# EAGLE design bee_duel_played (EAGLE 9.6.2)
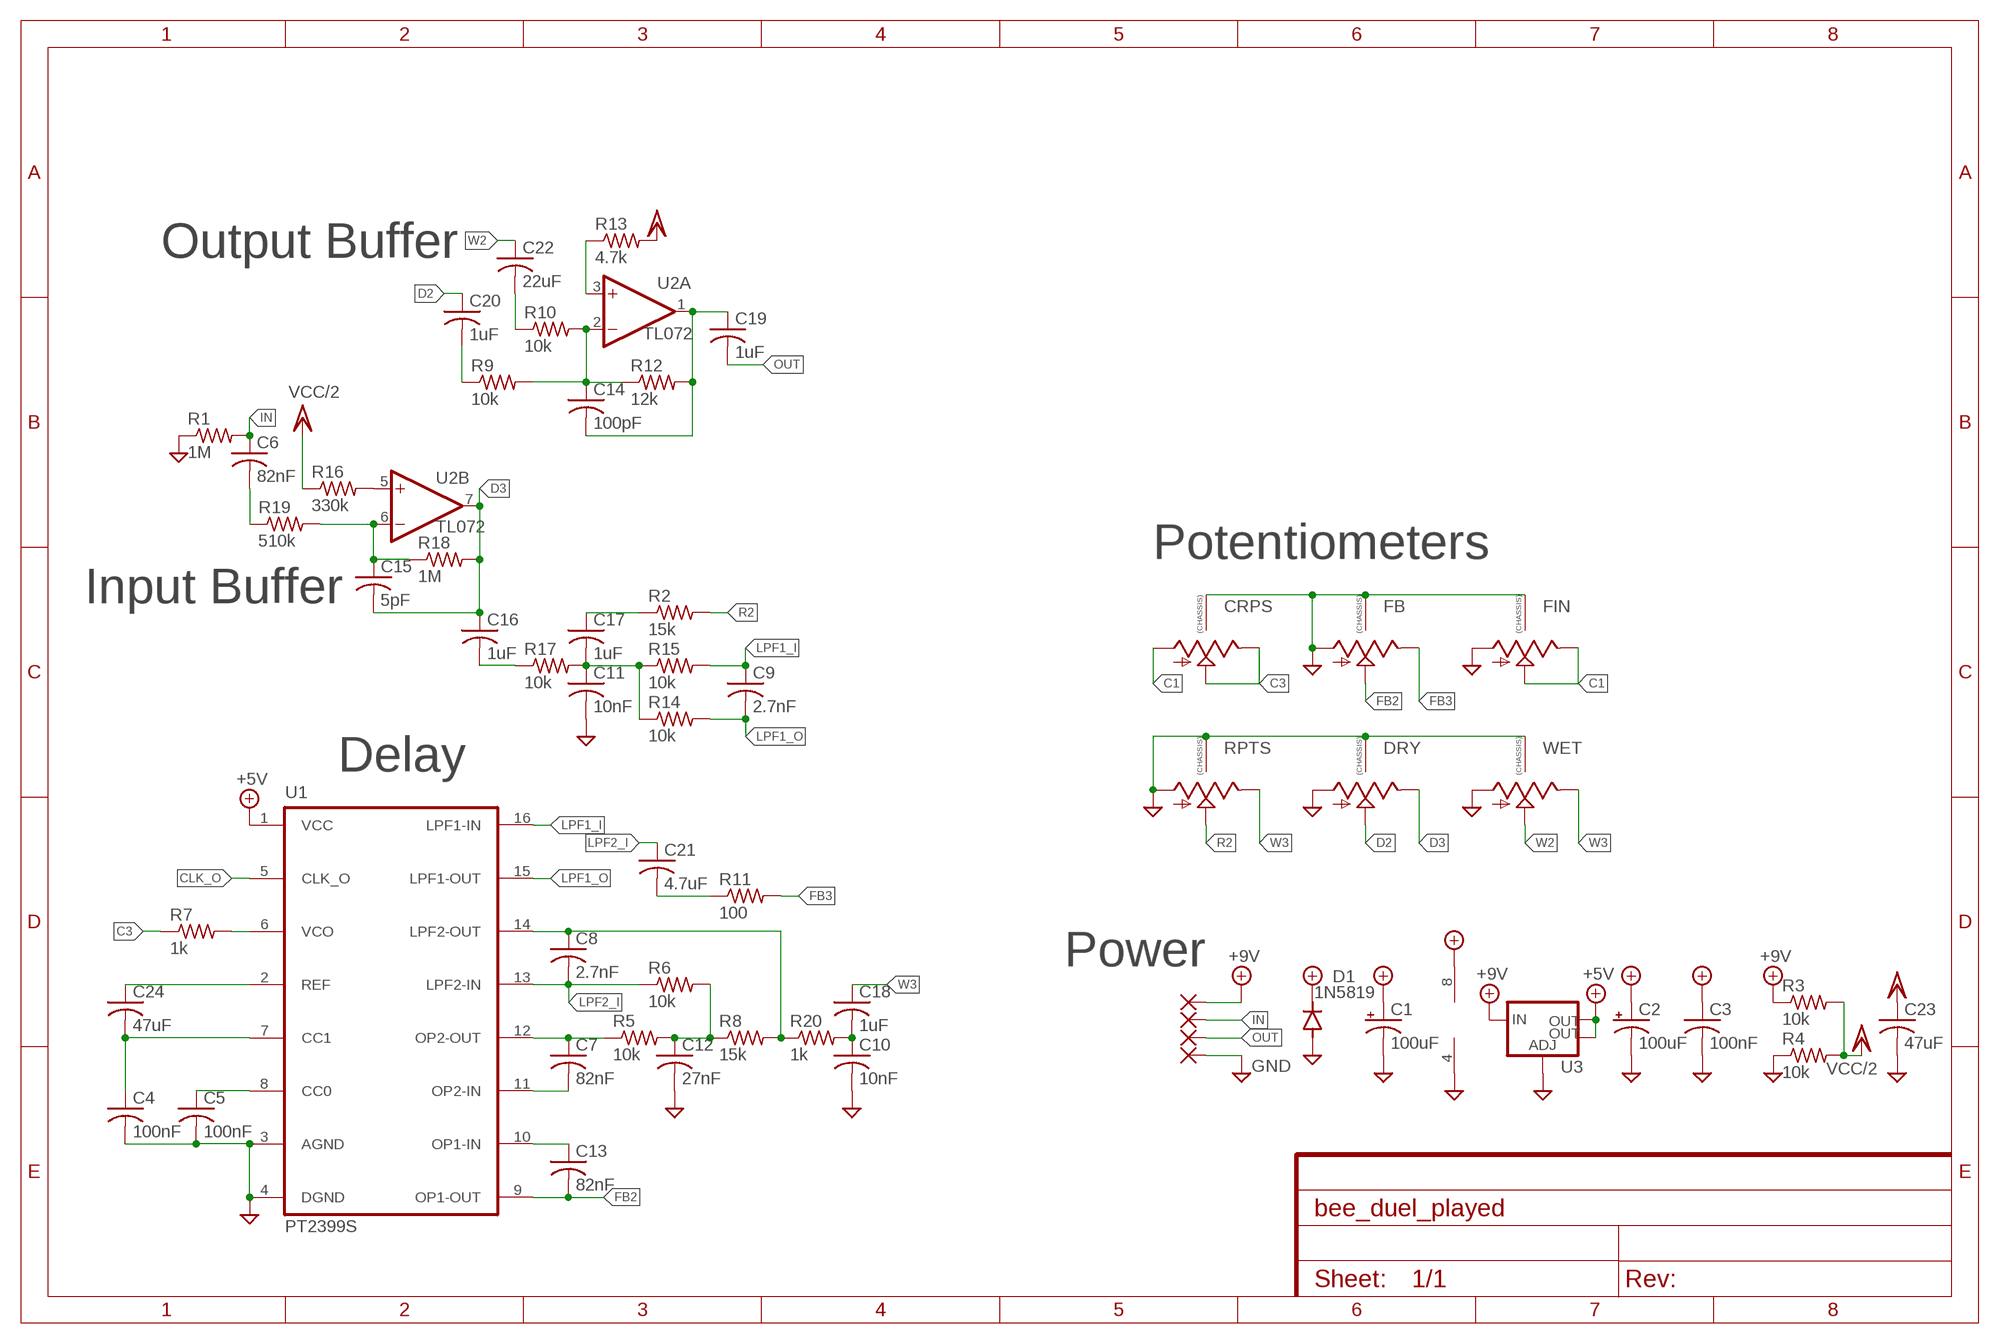
[diagram p0: schematic, sheet 1]

## Parts
C1  100uF  100UF-POLAR-RADIAL-2.5MM-25V-20%  [CPOL-RADIAL-2.5MM-6.5MM]
C2  100uF  100UF-POLAR-RADIAL-2.5MM-25V-20%  [CPOL-RADIAL-2.5MM-6.5MM]
C3  100nF  C-USC0603  [C0603]
C4  100nF  C-USC0603  [C0603]
C5  100nF  C-USC0603  [C0603]
C6  82nF  C-USC0603  [C0603]
C7  82nF  C-USC0603  [C0603]
C8  2.7nF  C-USC0603  [C0603]
C9  2.7nF  C-USC0603  [C0603]
C10  10nF  C-USC0603  [C0603]
C11  10nF  C-USC0603  [C0603]
C12  27nF  C-USC0603  [C0603]
C13  82nF  C-USC0603  [C0603]
C14  100pF  C-USC0603  [C0603]
C15  5pF  C-USC0603  [C0603]
C16  1uF  C-USC0603  [C0603]
C17  1uF  C-USC0603  [C0603]
C18  1uF  C-USC0603  [C0603]
C19  1uF  C-USC0603  [C0603]
C20  1uF  C-USC0603  [C0603]
C21  4.7uF  C-USC0805  [C0805]
C22  22uF  C-USC1210  [C1210]
C23  47uF  C-USC1210  [C1210]
C24  47uF  C-USC1210  [C1210]
CRPS  9MM_SNAP-IN_POT_CHASSIS  [9MM_SNAP-IN_POT]
D1  1N5819  DIODE-SOD123  [SOD123]
DRY  9MM_SNAP-IN_POT_CHASSIS  [9MM_SNAP-IN_POT]
FB  9MM_SNAP-IN_POT_CHASSIS  [9MM_SNAP-IN_POT]
FIN  9MM_SNAP-IN_POT_CHASSIS  [9MM_SNAP-IN_POT]
PAD1  1,6/0,8  [1,6/0,8]
PAD2  1,6/0,8  [1,6/0,8]
PAD3  1,6/0,8  [1,6/0,8]
PAD4  1,6/0,8  [1,6/0,8]
R1  1M  R-US_R0603  [R0603]
R2  15k  R-US_R0603  [R0603]
R3  10k  R-US_R0603  [R0603]
R4  10k  R-US_R0603  [R0603]
R5  10k  R-US_R0603  [R0603]
R6  10k  R-US_R0603  [R0603]
R7  1k  R-US_R0603  [R0603]
R8  15k  R-US_R0603  [R0603]
R9  10k  R-US_R0603  [R0603]
R10  10k  R-US_R0603  [R0603]
R11  100  R-US_R0603  [R0603]
R12  12k  R-US_R0603  [R0603]
R13  4.7k  R-US_R0603  [R0603]
R14  10k  R-US_R0603  [R0603]
R15  10k  R-US_R0603  [R0603]
R16  330k  R-US_R0603  [R0603]
R17  10k  R-US_R0603  [R0603]
R18  1M  R-US_R0603  [R0603]
R19  510k  R-US_R0603  [R0603]
R20  1k  R-US_R0603  [R0603]
RPTS  9MM_SNAP-IN_POT_CHASSIS  [9MM_SNAP-IN_POT]
U1  PT2399S  [SO16W]
U2  TL072  TL072TSSOP  [TSSOP-8]
U3  V_REG_LM1117SOT223  [SOT223]
WET  9MM_SNAP-IN_POT_CHASSIS  [9MM_SNAP-IN_POT]

## Nets
+5V: C2.1(+) C3.1 U1.1(VCC) U3.2(OUT) U3.4(OUT)
+9V: C1.1(+) D1.C PAD1.1(P) R3.1 U2.8(P:V+) U3.3(IN)
C1: CRPS.1(A) FIN.2(S) FIN.3(E)
C3: CRPS.2(S) CRPS.3(E) R7.1
CLK_O: U1.5(CLK_O)
D2: C20.1 DRY.2(S)
D3: C15.2 C16.1 DRY.3(E) R18.2 U2.7(B:OUT)
FB2: C13.2 FB.2(S) U1.9(OP1-OUT)
FB3: FB.3(E) R11.2
GND: C1.2(-) C2.2(-) C3.2 C4.2 C5.2 C10.2 C11.2 C12.2 C23.2 CRPS.CHASSIS1 CRPS.CHASSIS2 D1.A DRY.1(A) DRY.CHASSIS1 DRY.CHASSIS2 FB.1(A) FB.CHASSIS1 FB.CHASSIS2 FIN.1(A) FIN.CHASSIS1 FIN.CHASSIS2 PAD4.1(P) R1.1 R4.1 RPTS.1(A) RPTS.CHASSIS1 RPTS.CHASSIS2 U1.3(AGND) U1.4(DGND) U2.4(P:V-) U3.1(ADJ) WET.1(A) WET.CHASSIS1 WET.CHASSIS2
IN: C6.1 PAD2.1(P) R1.2
LPF1_I: C9.1 R15.2 U1.16(LPF1-IN)
LPF1_O: C9.2 R14.2 U1.15(LPF1-OUT)
LPF2_I: C8.2 C21.1 R6.1 U1.13(LPF2-IN)
LPF2_O: C8.1 R8.2 R20.1 U1.14(LPF2-OUT)
N$1: R16.2 U2.5(B:+IN)
N$2: C6.2 R19.1
N$3: C15.1 R18.1 R19.2 U2.6(B:-IN)
N$4: C16.2 R17.1
N$5: C11.1 C17.2 R14.1 R15.1 R17.2
N$6: C5.1 U1.8(CC0)
N$7: C17.1 R2.1
N$8: C13.1 U1.10(OP1-IN)
N$9: C7.2 U1.11(OP2-IN)
N$10: C7.1 R5.1 U1.12(OP2-OUT)
N$11: C12.1 R5.2 R6.2 R8.1
N$12: C10.1 C18.2 R20.2
N$13: C22.2 R10.1
N$14: C21.2 R11.1
N$15: C14.1 R9.2 R10.2 R12.1 U2.2(A:-IN)
N$16: R13.1 U2.3(A:+IN)
N$17: C4.1 C24.2 U1.7(CC1)
N$18: C24.1 U1.2(REF)
N$19: R7.2 U1.6(VCO)
N$20: C14.2 C19.1 R12.2 U2.1(A:OUT)
N$21: C20.2 R9.1
OUT: C19.2 PAD3.1(P)
R2: R2.2 RPTS.2(S)
VCC/2: C23.1 R3.2 R4.2 R13.2 R16.1
W2: C22.1 WET.2(S)
W3: C18.1 RPTS.3(E) WET.3(E)

## Notes on the sheet
- Output Buffer
- Potentiometers
- Input Buffer
- Delay
- Power

## Library data of the parts
C1 C2 = SparkFun-Capacitors:100UF-POLAR: 100µF polarized capacitors A capacitor is a passive two-terminal electrical component used to store electrical energy temporarily in an electric field.; PROD_ID: CAP-08439
C3-C24 = adafruit:C-US: CAPACITOR, American symbol
CRPS DRY FB FIN RPTS WET = MusicThingModular:9MM_SNAP-IN_POT_CHASSIS: 9mm vertical snap-in pot, Alpha / Panasonic style, with a connection to the metal chassis for grounding
D1 = diode:DIODE-: DIODE
PAD1-PAD4 = wirepad:1,6/0,8: THROUGH-HOLE PAD
R1-R20 = adafruit:R-US_: RESISTOR, American symbol
U1 = princeton-tech:PT2399: Echo Processor IC
U2 = MusicThingModular:TL072: Generic Dual Op Amp
U3 = SparkFun-IC-Power:V_REG_LM1117: Voltage Regulator LM1117 Standard adjustable voltage regulator but in SMD form. Spark Fun Electronics SKU : COM-00595; PROD_ID: VREG-08170

## Board
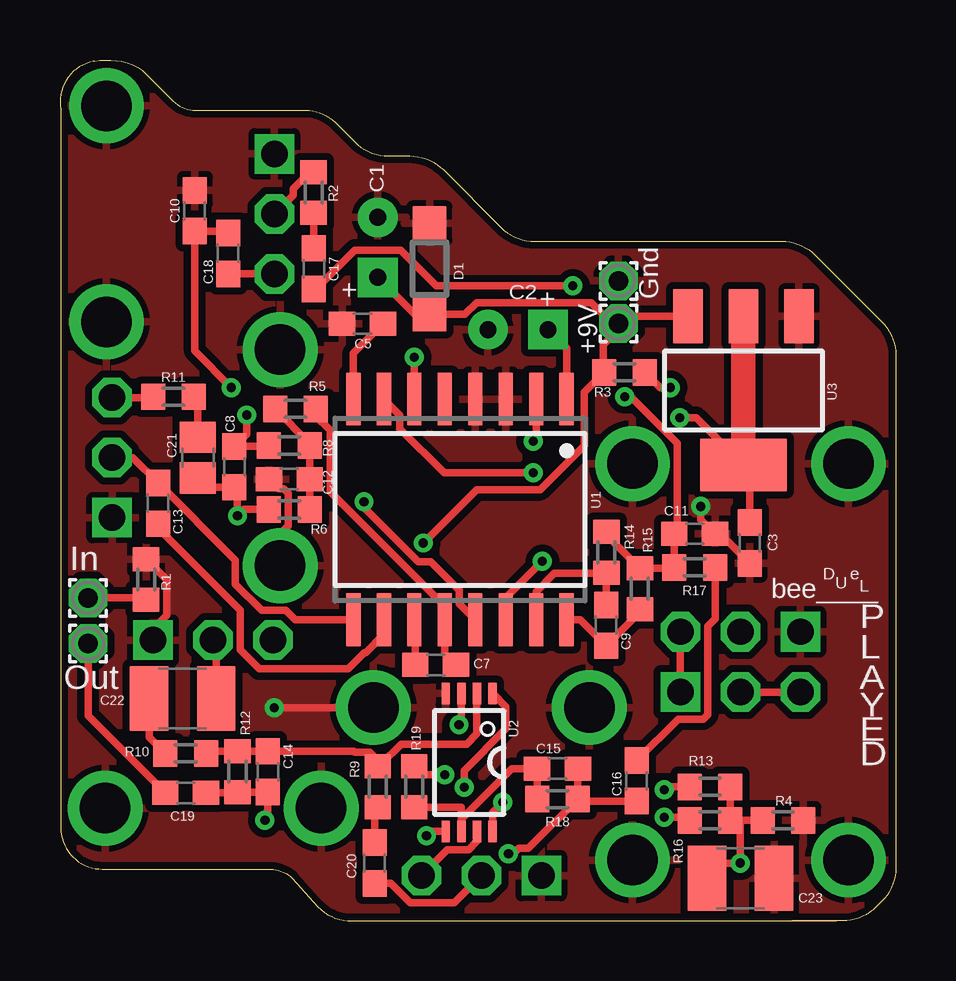
[diagram p1: board, top side]
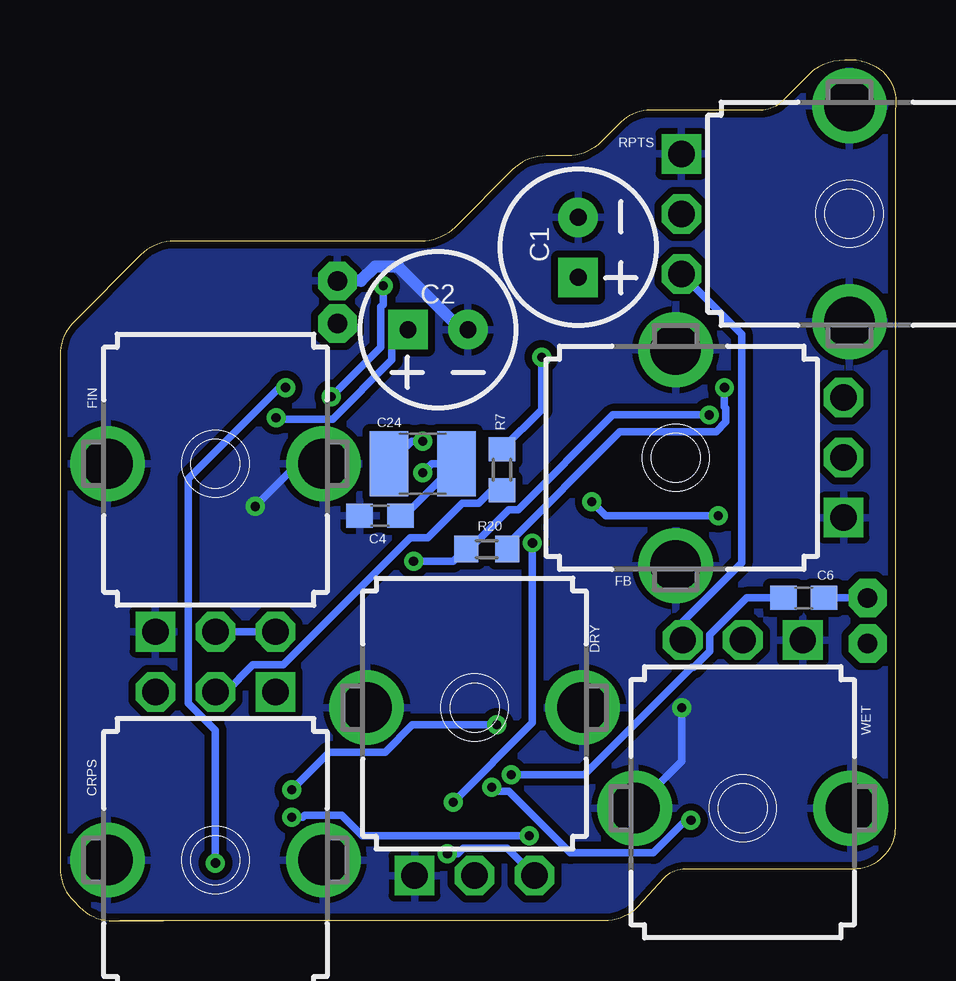
[diagram p2: board, bottom side, seen from below]

Size 34.83 x 35.87 mm. Coordinates in mm from the lower left corner, seen from the top.
Outline: 30.51,0 13.49,0 12.16,0 arc-45 10.75,0.59 9.68,1.78 arc45 8.76,2.16 1.76,2.16 arc-45 0.54,2.67 arc-45 0.03,3.89 0.03,4.06 0.03,33.81 arc-90 1.39,35.81 1.43,35.81 arc-45 3.44,35.45 4.73,34.16 arc45 5.65,33.78 10.23,33.78 arc-45 11.46,33.27 12.27,32.46 arc45 13.68,31.88 14.57,31.88 arc-45 15.98,31.29 18.37,28.91 arc45 19.78,28.32 30.06,28.32 arc-45 31.48,27.73 34.24,24.97 arc-45 34.83,23.56 34.83,2.23 arc-45 34.24,0.81 34.02,0.59 arc-45 32.6,0 30.51,0
Outline: 30.51,0 32.33,0
Copper layers (1*16): Top 0.035mm / dielectric 1.5mm / Bottom 0.035mm
Design rules "default *": minimum track width 6mil, minimum drill 0.35mm, track to track 6mil, track to pad 6mil, pad to pad 6mil, via to via 6mil, smd to smd 6mil, copper to edge 10mil, drill to drill 6mil, minimum pad ring 10mil, minimum via ring 8mil, stop-mask expansion 4mil, vias tented up to drill 0mil, thermal gap 10mil

### Footprints (pad centres in the part's own frame; a part is rotated, then mirrored left to right if it is on the bottom)
CPOL-RADIAL-2.5MM-6.5MM = drill 0.7 pad 1.651 square: 1 1.25,0 | drill 0.7 pad 1.651: 2 -1.25,0
C0603 = smd 1.1 x 1: 1 -0.85,0; 2 0.85,0
C0805 = smd 1.3 x 1.5: 1 -0.85,0; 2 0.85,0
C1210 = smd 1.6 x 2.7: 1 -1.4,0; 2 1.4,0
9MM_SNAP-IN_POT = drill 1.1 square: 1 -2.5,-7 | drill 1.1 octagon: 2 0,-7; 3 2.5,-7 | drill 2.1 pad 2.794: CHASSIS1 -4.5,0; CHASSIS2 4.5,0
SOD123 = smd 1.4 x 1.4: A 1.9,0; C -1.9,0
1,6/0,8 = drill 0.813 pad 1.6 octagon: 1 0,0
R0603 = smd 1 x 1.1: 1 -0.85,0; 2 0.85,0
SO16W = smd 0.6 x 2.2: 1 -4.445,-4.6; 2 -3.175,-4.6; 3 -1.905,-4.6; 4 -0.635,-4.6; 5 0.635,-4.6; 6 1.905,-4.6; 7 3.175,-4.6; 8 4.445,-4.6; 9 4.445,4.6; 10 3.175,4.6; 11 1.905,4.6; 12 0.635,4.6; 13 -0.635,4.6; 14 -1.905,4.6; 15 -3.175,4.6; 16 -4.445,4.6
TSSOP-8 = smd 0.9 x 0.35: 1 -2.875,0.975; 2 -2.875,0.325; 3 -2.875,-0.325; 4 -2.875,-0.975; 5 2.875,-0.975; 6 2.875,-0.325; 7 2.875,0.325; 8 2.875,0.975
SOT223 = smd 1.219 x 2.235: 1 -2.311,-3.099; 2 0,-3.099; 3 2.311,-3.099 | smd 3.6 x 2.2: 4 0,3.099

### Placement (x,y rotation side)
C1  13.24,28.07 270 bottom
C2  19.08,24.64 180 bottom
C3  28.73,15.75 270 top
C4  21.49,16.89 180 bottom
C5  12.6,24.89 180 top
C6  3.84,13.46 180 bottom
C7  15.65,10.67 180 top
C8  7.27,18.92 270 top
C9  22.76,12.32 90 top
C10  5.62,29.59 90 top
C11  26.45,16.13 0 top
C12  9.55,18.41 180 top
C13  4.09,17.4 90 top
C14  8.67,6.22 270 top
C15  20.73,6.35 0 top
C16  24.03,5.84 90 top
C17  10.57,27.18 270 top
C18  7.01,27.81 90 top
C19  5.24,5.33 180 top
C20  13.11,2.41 90 top
C21  5.74,19.3 90 top
C22  5.11,9.27 180 top
C23  28.35,1.78 0 top
C24  19.71,19.05 0 bottom
CRPS  28.35,2.54 180 bottom
D1  15.4,27.18 90 top
DRY  17.56,8.89 0 bottom
FB  9.17,19.3 90 bottom
FIN  28.35,19.05 0 bottom
PAD1  23.27,24.89 0 top
PAD2  1.17,13.46 0 top
PAD3  1.17,11.56 0 top
PAD4  23.27,26.67 0 top
R1  3.59,14.22 270 top
R2  10.57,30.35 90 top
R3  23.52,22.86 0 top
R4  30.13,4.19 180 top
R5  9.81,21.34 180 top
R6  9.55,17.14 0 top
R7  16.41,18.8 90 bottom
R8  9.55,19.81 180 top
R9  13.24,5.59 90 top
R10  5.24,6.99 0 top
R11  4.73,21.84 180 top
R12  7.4,6.22 270 top
R13  27.08,5.59 0 top
R14  22.76,15.37 270 top
R15  24.16,13.84 270 top
R16  27.08,4.19 180 top
R17  26.45,14.73 180 top
R18  20.73,5.08 0 top
R19  14.76,5.59 270 top
R20  17.05,15.49 0 bottom
RPTS  1.93,29.46 270 bottom
U1  16.67,17.14 180 top
U2  17.05,6.6 270 top
U3  28.48,22.1 180 top
WET  6.38,4.7 180 bottom

### Tracks (layer width: path | path; a pad name or v marks a point on that pad's centre or on a via)
+5V  (via drill 0.38)
  Top 0.305: C2.1 21.11,23.86 U1.1 | 28.73,18.75 C3.1 | v25.82,20.97 26.51,20.97 U3.4
  Top 1.016: U3.2 U3.4 28.73,18.75
  Bottom 0.305: C2.1 21,23.96 21,23.38 23.47,20.91 25.77,20.91 v25.82,20.97
+9V  (via drill 0.38)
  Top 0.305: U3.3 23.58,25.2 PAD1.1 23.27,24.64 | 23.27,24.64 22.64,24 22.64,22.9 R3.1 21.84,22.03 21.84,19.81 20,17.97 17.36,17.97 v15.14,15.75 | 23.27,24.64 22.14,25.77 17.36,25.77 16.87,25.28 D1.C 14.78,25.28 C1.1 | v18.44,4.95 18.02,4.53 U2.8
  Bottom 0.305: v15.14,15.75 15.14,8.26 v18.44,4.95
C1
  Top 0.305: FIN.3 CRPS.1
  Bottom 0.305: FIN.3 FIN.2
C3
  Top 0.305: CRPS.2 CRPS.3
  Bottom 0.305: CRPS.2 27.93,9.54 26.8,10.67 25.53,10.67 20.23,15.97 19.49,15.97 18.07,17.39 17.39,17.39 16.84,17.95 R7.1
D2
  Top 0.305: C20.1 13.78,1.56 14.59,0.76 16.43,0.76 DRY.2
D3  (via drill 0.38)
  Top 0.305: C15.2 R18.2 | U2.7 17.37,3.32 17.02,2.97 16.14,2.97 DRY.3 | C16.1 21.67,4.99 R18.2 | R18.2 19.52,3.02 19.1,3.02 18.88,2.79 v18.68,2.79
  Bottom 0.305: v18.68,2.79 18.25,2.79 18.02,3.02 16.19,3.02 DRY.3
FB2
  Top 0.305: FB.2 3.04,19.3 C13.2 7.31,15.03 7.31,14.03 8.4,12.94 9.4,12.94 9.8,12.54 U1.9
FB3
  Top 0.305: FB.3 3.84,21.8 R11.2
GND  (via drill 0.38)
  Top 0.305: C12.2 9.12,18 9.33,18 9.51,17.82 9.51,16.47 9.17,16.13 FB.CHASSIS1 | C3.2 27.5,16.13 C11.2 26.7,16.73 v26.7,17.27 | WET.1 3.88,12.19 4.44,12.75 4.44,14.22 R1.1 | v8.92,8.89 DRY.CHASSIS2
  Bottom 0.305: FIN.CHASSIS2 24.92,19.05 v26.7,17.27 | WET.CHASSIS2 8.92,6.66 v8.92,8.89
  Bottom 0.508: C2.2 18.1,24.64 20.73,27.27 21.7,27.27 22.29,26.67 PAD4.1
  pour Top (isolate 0.305): -5.05,-2.54 36.86,-2.54 36.86,36.83 -2.51,36.83 -2.51,0
  pour Bottom (isolate 0.305): -2.51,-2.54 -2.51,36.83 36.86,36.83 36.86,-2.54
IN
  Top 0.305: PAD2.1 3.5,13.46 R1.2
  Bottom 0.305: PAD2.1 C6.1
LPF1_I
  Top 0.305: U1.16 21.69,12.54 C9.1 24.16,12.87 R15.2
LPF1_O
  Top 0.305: C9.2 R14.2 22.72,14.48 20.6,14.48 19.84,13.72 U1.15
LPF2_I  (via drill 0.38)
  Top 0.305: C21.1 6.13,18.07 C8.2 7.4,17.95 v7.4,16.89 7.65,17.14 R6.1 | U1.13 16.64,13.21 16.64,13.77 15.44,14.97 14.94,14.97 12.66,17.24 v12.66,17.46
  Bottom 0.305: v12.66,17.46 12.09,16.89 v7.4,16.89
LPF2_O  (via drill 0.38)
  Top 0.305: R8.2 8.67,19.77 C8.1 7.78,20.28 v7.78,21.08 | U1.14 18.57,13.46 v20.1,14.99
  Bottom 0.305: v20.1,14.99 18.44,14.99 17.94,15.49 R20.1 17.77,15.49 16.12,17.14 15.74,17.14 11.8,21.08 v7.78,21.08
N$1  (via drill 0.38)
  Top 0.305: U2.5 15.44,3.73 v15.27,3.56 | v25.18,4.32 26.1,4.32 R16.2
  Bottom 0.305: v15.27,3.56 22.23,3.56 23.08,4.4 24.62,4.4 24.71,4.32 v25.18,4.32
N$2  (via drill 0.38)
  Top 0.305: v16.03,6.1 15.1,6.1 R19.1
  Bottom 0.305: v16.03,6.1 12.98,6.1 8.51,10.57 8.41,10.57 7.75,11.23 7.75,11.93 6.21,13.46 C6.2
N$3
  Top 0.305: R18.1 C15.1 18.83,6.35 16.72,4.25 U2.6 16.72,4.74 R19.2
N$4
  Top 0.305: R17.1 27.3,12.59 26.98,12.28 26.98,8.59 26.8,8.41 25.75,8.41 C16.2
N$5  (via drill 0.38)
  Top 0.305: R14.1 22.76,16.09 R15.1 25.56,14.69 R17.2 C11.1 25.71,16.25 25.71,19.91 23.78,21.84 v23.52,21.84 | C17.2 10.67,26.33 12.29,27.95 14.19,27.95 15.67,26.47 v21.37,26.47
  Bottom 0.305: v23.52,21.84 21.46,23.91 21.46,25.59 21.37,25.68 v21.37,26.47
N$6
  Top 0.305: U1.8 12.22,23.66 C5.1
N$7
  Top 0.305: R2.1 C17.1
N$8
  Top 0.305: C13.1 4.09,16.36 7.51,12.94 7.51,11.29 8.3,10.51 12.01,10.51 12.68,11.18 12.73,11.18 13.49,11.94 U1.10
N$9
  Top 0.305: C7.2 14.8,12.51 U1.11
N$10
  Top 0.305: C7.1 16.03,11.14 U1.12 16.03,13.11 11.26,17.88 11.26,20.44 10.66,21.04 R5.1
N$11
  Top 0.305: R6.2 C12.1 R8.1 10.4,19.89 R5.2
N$12  (via drill 0.38)
  Top 0.305: C18.2 6.94,28.74 C10.1 5.62,23.75 v7.14,22.23
  Bottom 0.305: R20.2 16.2,15.68 11.49,20.38 7.49,20.38 7.08,20.79 7.08,21.37 7.14,21.43 v7.14,22.23
N$13
  Top 0.305: R10.1 3.71,7.66 C22.2
N$14
  Top 0.305: R11.1 5.74,21.68 C21.2
N$15
  Top 0.305: 6.17,7.07 R12.1 C14.1 12.24,7.07 12.28,7.03 12.9,7.03 13.41,6.52 13.36,6.52 | R9.2 13.15,6.52 13.36,6.52 | U2.2 17.37,7.8 16.94,7.37 14.21,7.37 13.36,6.52
  Top 0.508: R10.2 6.17,7.07
N$16  (via drill 0.38)
  Top 0.305: v16.62,8.17 16.72,8.27 U2.3 | v25.18,5.46 25.3,5.59 R13.1
  Bottom 0.305: v16.62,8.17 20.14,8.17 21.28,7.03 23.61,7.03 v25.18,5.46
N$17  (via drill 0.38)
  Top 0.305: U1.7 14.16,21.08 14.16,20.52 16.01,18.67 v19.71,18.67
  Bottom 0.305: v19.71,18.67 19.33,19.05 C24.2 20.47,16.89 C4.1
N$18  (via drill 0.38)
  Top 0.305: v19.71,19.99 19.84,20.12 U1.2
  Bottom 0.305: C24.1 20.17,19.99 v19.71,19.99
N$19  (via drill 0.38)
  Top 0.305: v14.76,23.5 U1.6
  Bottom 0.305: R7.2 14.76,21.3 v14.76,23.5
N$20  (via drill 0.38)
  Top 0.305: C19.1 7.36,5.33 R12.2 C14.2 8.67,4.32 v8.54,4.19 | v16.84,5.57 16.84,6.27 18.57,8 18.57,8.93 U2.1
  Bottom 0.305: v16.84,5.57 16.66,5.4 16.12,5.4 13.56,2.84 10.11,2.84 8.75,4.19 v8.54,4.19
N$21
  Top 0.305: C20.2 13.11,4.61 R9.1
OUT
  Top 0.305: C19.2 1.17,8.55 PAD3.1
R2
  Top 0.305: RPTS.2 9.72,30.25 9.72,30.51 10.41,31.2 R2.2
VCC/2  (via drill 0.38)
  Top 0.305: R13.2 R16.1 28.35,4.19 | 28.35,4.19 R4.2 | R3.2 25.01,22.23 v25.43,22.23 | C23.1 27.59,2.41 v28.35,2.41 28.35,4.19
  Bottom 0.305: v28.35,2.41 28.35,7.94 29.48,9.07 29.48,18.43 25.68,22.23 v25.43,22.23
W2
  Top 0.305: WET.2 6.51,11.57 C22.1
W3
  Top 0.305: C18.1 RPTS.3
  Bottom 0.305: WET.3 8.88,12.46 6.42,14.92 6.42,24.45 RPTS.3

### Text on the board
tPlace: C1 | + | C2 | + | Gnd | +9V | In | D | U | e | L | bee____ | P | L | Out | A | Y | E | D